# Altium schematic sheet Peripherals.SchDoc
size A3; SheetNumber: 7; SheetTotal: 9
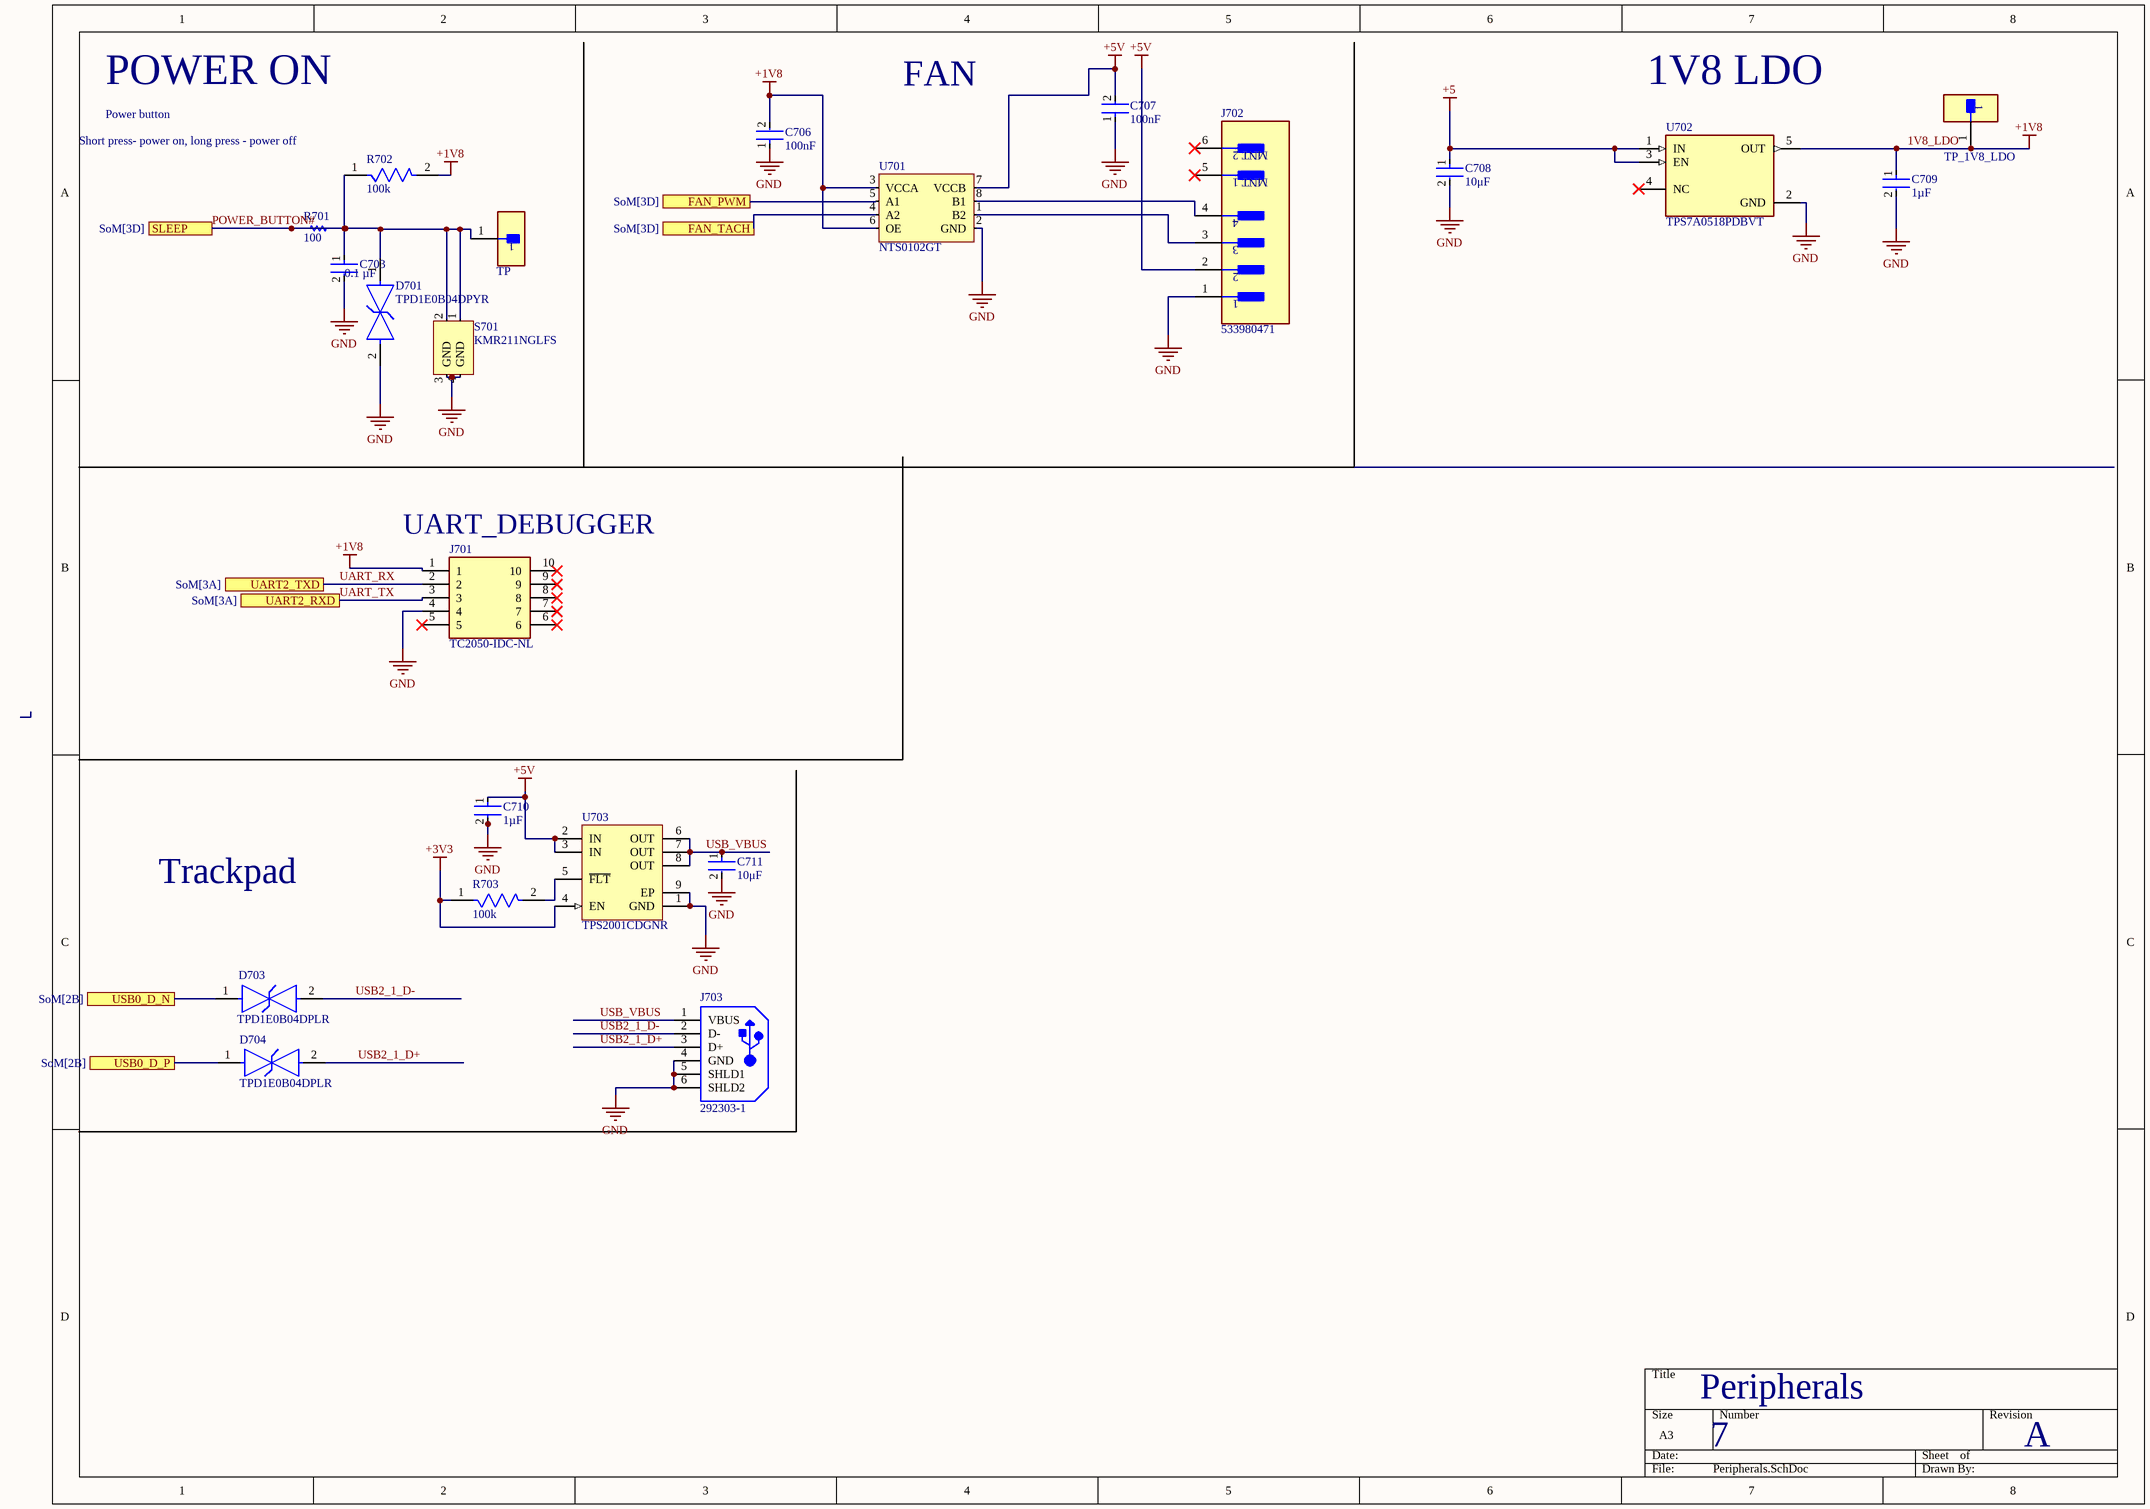
[diagram p0: Peripherals.SchDoc]

## Parts
C703  0.1 µF  [FP-GRM155-0_05-IPC_B]
C706  100nF  [FP-GRM155-0_05-IPC_B]
C707  100nF  [FP-GRM155-0_05-IPC_B]
C708  10μF  [FP-GRM31C-0_2-e0_3_0_8-MFG]
C709  1µF  [FP-GRM15-0_1-MFG]
C710  1µF  [FP-GRM15-0_1-MFG]
C711  10μF  [FP-GRM31C-0_2-e0_3_0_8-MFG]
D701  TPD1E0B04DPYR  [FP-DPY0002A-MFG]
D703  TPD1E0B04DPLR  [FP-DPL0002A-MFG]
D704  TPD1E0B04DPLR  [FP-DPL0002A-MFG]
J701  TC2050-IDC-NL  [TAG-CONNECT_TC2050-IDC-NL]
J702  533980471  [FP-533980471-MFG]
J703  292303-1  [TE-292303-1_V]
R701  100  [RESC1005X40X25ML05T10]
R702  100k  [FP-RC0402-0_4-IPC_A]
R703  100k  [FP-RC0402-0_4-IPC_A]
S701  KMR211NGLFS  [SW_KMR211NGLFS]
TP700  TP  [FP-S2751-46R-MFG]
TP701  TP_1V8_LDO  [FP-S2751-46R-MFG]
U701  NTS0102GT  [PSON50P100X195X50-8N]
U702  TPS7A0518PDBVT  [SOT95P280X145-5N]
U703  TPS2001CDGNR  [DGN0008D_L]

## Ports
FAN_PWM (see SoM[3D]), FAN_TACH (see SoM[3D]), SLEEP (see SoM[3D]), UART2_RXD (see SoM[3A]), UART2_TXD (see SoM[3A]), USB0_D_N (see SoM[2B]), USB0_D_P (see SoM[2B])

## Nets
1V8_LDO: C706.2 C709.1 J701.1 R702.2 TP701.1 U701.3(VCCA) U701.6(OE) U702.5(OUT)  [also labelled +1V8]
+3V3: R703.1 U703.4(EN)
+5: C708.1 U702.1(IN) U702.3(EN)
+5V: C707.2 C710.1 J702.2 U701.7(VCCB) U703.2(IN) U703.3(IN)
GND: C703.2 C706.1 C707.1 C708.2 C709.2 C710.2 C711.2 D701.2(2_IO) J701.4 J702.1 J703.4(GND) J703.5(SHLD1) J703.6(SHLD2) S701.3(GND) S701.4(GND) U701.2(GND) U702.2(GND) U703.1(GND) U703.9(EP)
FAN_PWM: U701.5(A1) ; port FAN_PWM
FAN_TACH: U701.4(A2) ; port FAN_TACH
POWER_BUTTON#: C703.1 D701.1(1_IO) R701.1 R701.2 R702.1 S701.1 S701.2 TP700.1 ; port SLEEP
UART_RX: J701.2 ; port UART2_TXD
UART_TX: J701.3 ; port UART2_RXD
USB0_D_N: D703.1(1_IO) ; port USB0_D_N
USB0_D_P: D704.1(1_IO) ; port USB0_D_P
USB2_1_D+: D704.2(2_IO) J703.3(D+)
USB2_1_D-: D703.2(2_IO) J703.2(D-)
USB_VBUS: C711.1 J703.1(VBUS) U703.6(OUT) U703.7(OUT) U703.8(OUT)
NetJ702_3: J702.3 U701.1(B2)
NetJ702_4: J702.4 U701.8(B1)
NetR703_2: R703.2 U703.5(~{FLT})

Not connected (* = marked no-connect by the designer): J701 5* 6* 7* 8* 9* 10*; J702 5(MNT_1)* 6(MNT_2)*; U702 4(NC)*

## Notes on the sheet
- POWER ON
- FAN
- (near U702) 1V8 LDO
- (near R702) Short press- power on, long press - power off
- Power button
- (near J701) UART_DEBUGGER
- Trackpad
- Peripherals
- 7
- A

## Library data of the parts
C703 = CMP-06035-003750-1: Chip Multilayer Ceramic Capacitors for General Purpose, 0402, 0.10uF, X7R, 15%, 10%, 50V; Capacitance: 100nF; Weight: 0.000212oz; Package Quantity: 50000; Resistor Type: Ceramic; Mount: Surface Mount; Width: 0.5mm; Case Code (Imperial): 0402; Termination: SMD/SMT; Case/Package: 0402; Voltage Rating: 50V; Height: 0.5mm; Length: 0.039inch; Dielectric: X7R; Case Code (Metric): 1005; Min Operating Temperature: -55°C; Thickness: 0.022inch; Tolerance: 10%; Lead Free: Lead Free; Packaging: Tape and Reel; Max Operating Temperature: 125°C; Voltage Rating (DC): 50V
C706 C707 = CMP-2008-04639-2: Chip Multilayer Ceramic Capacitors for General Purpose, 0402, 0.10uF, X7R, 15%, 10%, 50V; Dissipation Factor: 0.025%; Weight: 0.000212oz; Thickness: 0.022inch; Voltage Rating (DC): 50V; Dielectric Material: Ceramic; Termination: SMD/SMT; Case/Package: 0402; Case Code (Imperial): 0402; Mount: Surface Mount; REACH SVHC: No SVHC; Resistor Type: Ceramic; Dielectric: X7R; Max Operating Temperature: 125°C; Voltage: 50V; Lead Free: Lead Free; Package Quantity: 10000; Packaging: Tape and Reel; Capacitance: 100nF; Length: 1mm; Material: Ceramic; Height: 0.5mm; Depth: 0.5mm; Width: 0.5mm; Min Operating Temperature: -55°C; Tolerance: 10%; Case Code (Metric): 1005; Voltage Rating: 50V
C708 C711 = CMP-06035-005515-1: Chip Multilayer Ceramic Capacitors for General Purpose, 1206, 10uF, X7R, 15%, 10%, 25V; Dielectric: X7R; Max Operating Temperature: 125°C; Capacitance: 10uF; Voltage Rating (DC): 25V; Case/Package: 1206; Thickness: 0.071inch; Tolerance: 10%; Voltage Rating: 25V; Mount: Surface Mount; Width: 0.063inch; Length: 0.126inch; Min Operating Temperature: -55°C; Packaging: Tape and Reel; Lead Free: Lead Free; Voltage: 25V
C709 C710 = CMP-2008-04556-2: CAP CER 1UF 10V X5R 0402; Manufacturer Part Number: GRM155R61A105KE15D; Manufacturer: Murata; Material: Ceramic; Tolerance: 10%; Temperature Coefficient: 15%; Octopart: https://octopart.com/grm155r61a105ke15d-murata-197442; Lead Free: Yes; ComponentLink2Description: Datasheet; Temperature: -55°C to +85°C; Temperature Range High: +85°C; Height: 0.55mm; Capacitance: 1uF; Ipc Land Pattern Name: CAPC10050X50; ComponentLink2URL: https://search.murata.co.jp/Ceramy/image/img/A01X/G101/ENG/GRM155R61A105KE15-01A.pdf; Temperature Range Low: -55°C; Device Class L2: Capacitors; Voltage Rating: 10V; RoHS: TRUE; Device Class L1: Passive Components; Device Class L3: Ceramic Capacitors; Temperature Characteristic: X5R; Mouser Description: 0402 1 uF 10 V ±10% Tolerance X5R Surface Mount Multilayer Ceramic Capacitor; Automotive: No; Package: GRM15-0.1; Digikey Description: CAP CER 1UF 10V X5R 0402; Value: 1uF; Category: Cap
D701 = CMP-04989-000020-1: TVS DIODE 3.6V 19V 2X1SON; Number of Channels: 1; Power Line Protection: No; Peak Pulse Current: 1.7A; Peak Pulse Power: 15W; Interface: USB; Min Breakdown Voltage: 6.7V; Case Code (Imperial): 0402; Resistor Type: Zener; RoHS Compliant: Yes; Case/Package: 0402; Case Code (Metric): 1006; Max Operating Temperature: 125°C; Packaging: Cut Tape; Clamping Voltage: 19V; Mount: Surface Mount; Number of Bidirectional Channels: 1; Min Operating Temperature: -40°C; Reverse Standoff Voltage: 3.6V
D703 D704 = CMP-04989-000017-1: TVS DIODE 3.6V 10.1V 2X2SON; Interface: USB; Number of Channels: 1; Max Operating Temperature: 125°C; Min Operating Temperature: -40°C; RoHS Compliant: Yes; Lead Free: Lead Free
J701 = CMP-002-00074-1: Adapter Cbl Plug Of Nails 10PIN
J702 = CMP-04776-000105-1: CONN HEADER SMD 4POS 1.25MM; Manufacturer: Molex; Conn Gender: Male; Conn Orientation: Vertical; Standoff Height: 0.05mm; Number Of Contacts: 4; Current Rating: 1A; Voltage Rating: 125V; Package: 0; ComponentLink2Description: Datasheet; ComponentLink2URL: https://www.molex.com/pdm_docs/ps/PS-51021-024-001.pdf; Ambient Temperature Range Low: -40°C; Category: Conn; Automotive: No; Number Of Rows: 1; Device Class L3: unset; Ambient Temperature Range High: +105°C; Height: 5.1mm; Lead Free: Yes; Pitch: 1.25mm; Contact Material: Tin; Footprint Url: https://www.molex.com/pdm_docs/sd/533980471_sd.pdf; Octopart: https://octopart.com/53398-0471-molex-655296; Temperature Range Low: -40°C; Device Class L2: Headers and Wire Housings; Temperature: -40°C to +105°C; Digikey Description: CONN HEADER SMD 4POS 1.25MM; RoHS: TRUE; Manufacturer Part Number: 533980471; Device Class L1: Connectors; Temperature Range High: +105°C
J703 = CMP-2000-05404-1: 1 Port Right Angle Through Hole Mount Female Type A USB Connector, 4 Position, -55 to 85 degC, RoHS, Tube; Manufacturer: TE Connectivity; Contact Termination Type: Solder; No. of Contacts: 4; Connector Mounting: PCB; SVHC: NoSVHC(16-Jun-2014); Gender: Receptacle; Connector Type: USBA; Package Description: 4-Pin Through Hole Device, Body 14 x 13.13 mm, Pitch 2.5 mm; Contact Plating: Gold; Package Reference: 292303-1; Contact Material: Copper; Datasheet URL: http://www.farnell.com/cad/1653030.pdf; Datasheet Version: Feb-12; Manufacturer URL: http://www.te.com/
R701 = CMP-2002-07344-1: Part Number: RC0402FR-07100RL; Manufacturer: Yageo / Phycomp
R702 R703 = CMP-2002-07913-2: RES 100K OHM 5% 1/16W 0402; Temperature Coefficient: 100ppm/°C; Max Power Dissipation: 63mW; Resistance: 100kR; Voltage Rating: 50V; Tolerance: 5%; Packaging: Tape and Reel; Termination: SMD/SMT; Case Code (Metric): 1005; Length: 1mm; Power Rating: 63mW; Min Operating Temperature: -55°C; Case/Package: 0402; Construction: Rectangular; Series: RC; Resistance Tolerance: 5%; Height: 0.016inch; Case Code (Imperial): 0402; RoHS Compliant: Yes; Size Code: 0402; Number of Terminations: 2; Features: Moisture Resistant; Width: 0.02inch; Max Operating Temperature: 155°C; Military Standard: Not; Lead Free: Lead Free; Depth: 0.5mm; Package Quantity: 1; Resistor Type: Thick Film
S701 = CMP-016-00013-1: Switch Tactile N.O. SPST Round Button Gull Wing 0.05A 32VDC 1VA 200000Cycle 1.2N SMD T/R; Mounting Technology: Surface Mount; Min Operating Temperature: -40°C; Case/Package: SMD/SMT; Max Operating Temperature: 85°C
TP700 TP701 = CMP-15817-000010-1: PC TEST POINT NATURAL; Plating: Tin; Body Material: Brass; Color: Natural; Material: Copper Alloy; Mount: Surface Mount; Packaging: Cut Tape
U701 = CMP-015-00011-1: Line Transceiver, PDSO8, 1 X 1.95 Mm, 0.50 Mm Height, Plastic, MO-252, SOT833-1, SON-8; Max Supply Voltage: 3.6V; Min Supply Voltage: 1.65V; Pins: 8; Mounting Technology: Standard; Max Operating Temperature: 125°C; Min Operating Temperature: -40°C
U702 = CMP-019-00049-1: 200mA, ultra-low-IQ, high-accuracy, low-dropout voltage regulator with enable 5-SOT-23 -40 to 125; Output Voltage: 1.8V; Pins: 5; Case/Package: SOT-23
U703 = CMP-0337-00296-2: Single Channel, Current-Limited USB Power Distribution Switch, 2.9 A Current Limit, -40 to 85 degC, 8-pin MSOP-PowerPAD (DGN), Green (RoHS & no Sb/Br); Manufacturer: Texas Instruments; Enable: Active High; rDS(on) per FET(Typ)(mOhms): 70; Current Limit(A): 2.9; Discharge Function: TRUE; Vin(Max)(V): 5.5; Vin(Min)(V): 4.5; Rating: Catalog; Number of Switches: 1; Continuous Current(Max)(A): 2; PackageReference: DGN0008D; ComponentLink1Description: Datasheet; DatasheetVersion: SLVSAU6E; Eco-Plan: Green (RoHS & no Sb/Br); Code_JEDEC: MO-187-AA-T; PackageDescription: 8-Pin PowerPAD Plastic Small Outline Package 3 x 3 mm Body ,0.65 mm Pitch, Exposed Pad; PackageVersion: revF, May-2011; UL Listed: TRUE; PartNumber: TPS2001CDGNR; Mounting Technology: Surface Mount; ComponentLink1URL: http://www.ti.com/general/docs/lit/getliterature.tsp?genericPartNumber=TPS2001C&fileType=pdf